# Altium project Project-C-V4.PrjPCB (part 1 of 3)
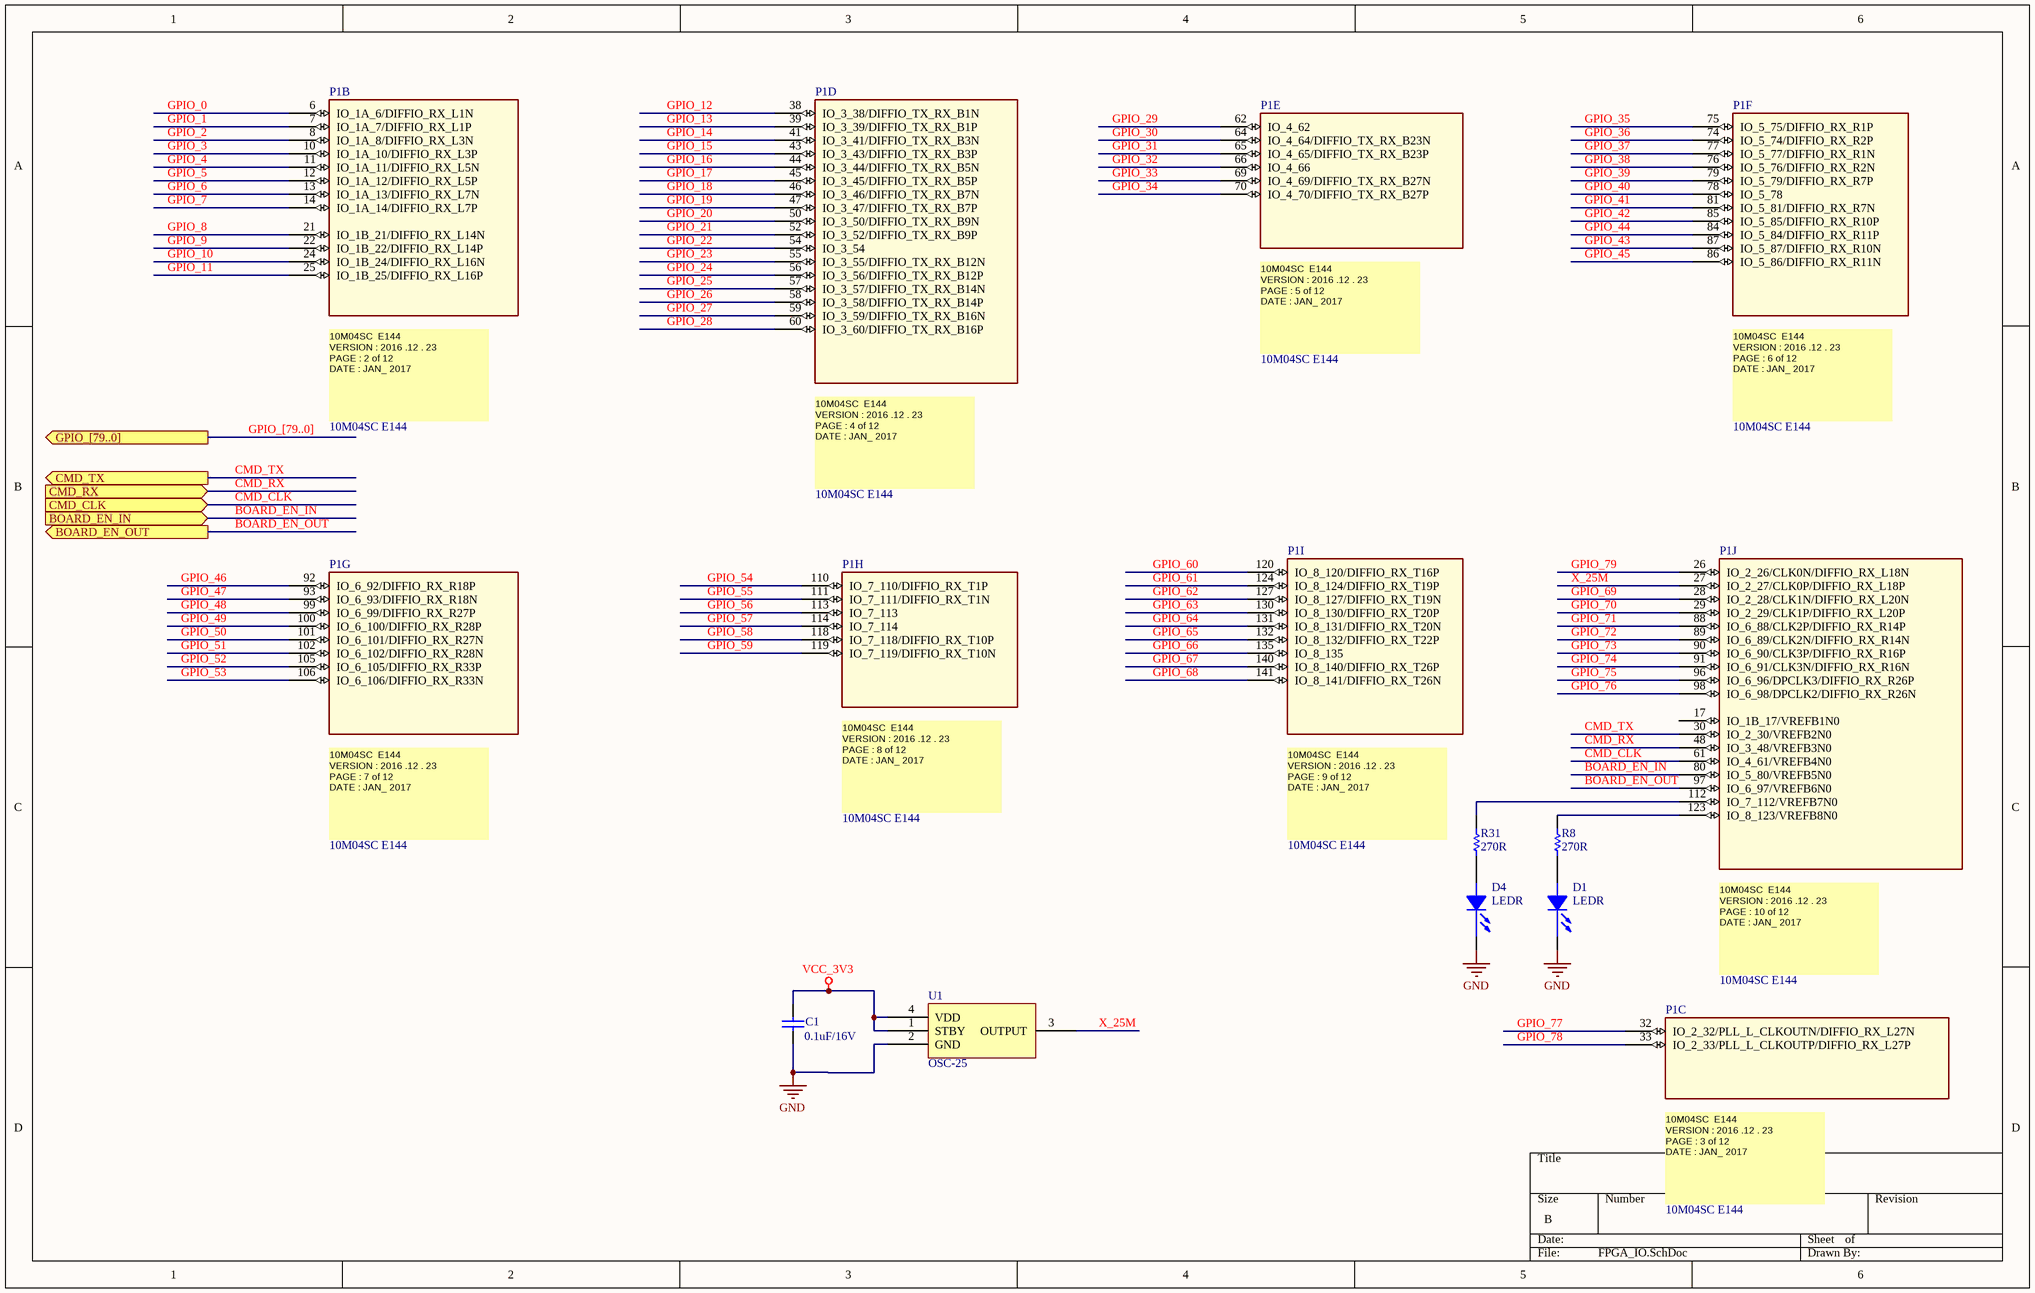
[diagram p0: FPGA_IO.SchDoc]
13 sheets, 1054 parts. Net scope: hierarchical (ports join the sheet entries above them; power ports are global).
Sheets:
  FPGA_IO.SchDoc
  FPGA_POWER.SchDoc
  FPGA_CONFIG.SchDoc
  TOP.SchDoc
    U_TOP_VOLTAGE = TOP_VOLTAGE.SchDoc
      VOLT1 = VoltageAmplifier.SchDoc
      VOLT2 = VoltageAmplifier.SchDoc
      VOLT3 = VoltageAmplifier.SchDoc
      VOLT4 = VoltageAmplifier.SchDoc
      VOLT5 = VoltageAmplifier.SchDoc
      VOLT6 = VoltageAmplifier.SchDoc
      VOLT7 = VoltageAmplifier.SchDoc
      VOLT8 = VoltageAmplifier.SchDoc
      VOLT9 = VoltageAmplifier.SchDoc
      VOLT10 = VoltageAmplifier.SchDoc
      VOLT11 = VoltageAmplifier.SchDoc
      VOLT12 = VoltageAmplifier.SchDoc
      VOLT13 = VoltageAmplifier.SchDoc
      VOLT14 = VoltageAmplifier.SchDoc
      VOLT15 = VoltageAmplifier.SchDoc
      VOLT16 = VoltageAmplifier.SchDoc
      VOLT17 = VoltageAmplifier.SchDoc
      VOLT18 = VoltageAmplifier.SchDoc
      VOLT19 = VoltageAmplifier.SchDoc
      VOLT20 = VoltageAmplifier.SchDoc
      VOLT21 = VoltageAmplifier.SchDoc
      VOLT22 = VoltageAmplifier.SchDoc
      VOLT23 = VoltageAmplifier.SchDoc
      VOLT24 = VoltageAmplifier.SchDoc
      VOLT25 = VoltageAmplifier.SchDoc
      VOLT26 = VoltageAmplifier.SchDoc
      VOLT27 = VoltageAmplifier.SchDoc
      VOLT28 = VoltageAmplifier.SchDoc
      VOLT29 = VoltageAmplifier.SchDoc
      VOLT30 = VoltageAmplifier.SchDoc
      VOLT31 = VoltageAmplifier.SchDoc
      VOLT32 = VoltageAmplifier.SchDoc
      VOLT33 = VoltageAmplifier.SchDoc
      VOLT34 = VoltageAmplifier.SchDoc
      VOLT35 = VoltageAmplifier.SchDoc
      VOLT36 = VoltageAmplifier.SchDoc
      VOLT37 = VoltageAmplifier.SchDoc
      VOLT38 = VoltageAmplifier.SchDoc
      VOLT39 = VoltageAmplifier.SchDoc
      VOLT40 = VoltageAmplifier.SchDoc
      VOLT41 = VoltageAmplifier.SchDoc
      VOLT42 = VoltageAmplifier.SchDoc
      VOLT43 = VoltageAmplifier.SchDoc
      VOLT44 = VoltageAmplifier.SchDoc
      VOLT45 = VoltageAmplifier.SchDoc
      VOLT46 = VoltageAmplifier.SchDoc
      VOLT47 = VoltageAmplifier.SchDoc
      VOLT48 = VoltageAmplifier.SchDoc
      VOLT49 = VoltageAmplifier.SchDoc
      VOLT50 = VoltageAmplifier.SchDoc
      VOLT51 = VoltageAmplifier.SchDoc
      VOLT52 = VoltageAmplifier.SchDoc
      VOLT53 = VoltageAmplifier.SchDoc
      VOLT54 = VoltageAmplifier.SchDoc
      VOLT55 = VoltageAmplifier.SchDoc
      VOLT56 = VoltageAmplifier.SchDoc
      VOLT57 = VoltageAmplifier.SchDoc
      VOLT58 = VoltageAmplifier.SchDoc
      VOLT59 = VoltageAmplifier.SchDoc
      VOLT60 = VoltageAmplifier.SchDoc
      VOLT61 = VoltageAmplifier.SchDoc
      VOLT62 = VoltageAmplifier.SchDoc
      VOLT63 = VoltageAmplifier.SchDoc
      VOLT64 = VoltageAmplifier.SchDoc
      VOLT65 = VoltageAmplifier.SchDoc
      VOLT66 = VoltageAmplifier.SchDoc
      VOLT67 = VoltageAmplifier.SchDoc
      VOLT68 = VoltageAmplifier.SchDoc
      VOLT69 = VoltageAmplifier.SchDoc
      VOLT70 = VoltageAmplifier.SchDoc
      VOLT71 = VoltageAmplifier.SchDoc
      VOLT72 = VoltageAmplifier.SchDoc
      VOLT73 = VoltageAmplifier.SchDoc
      VOLT74 = VoltageAmplifier.SchDoc
      VOLT75 = VoltageAmplifier.SchDoc
      VOLT76 = VoltageAmplifier.SchDoc
      VOLT77 = VoltageAmplifier.SchDoc
      VOLT78 = VoltageAmplifier.SchDoc
      VOLT79 = VoltageAmplifier.SchDoc
      VOLT80 = VoltageAmplifier.SchDoc
      VOLT81 = VoltageAmplifier.SchDoc
      VOLT82 = VoltageAmplifier.SchDoc
      VOLT83 = VoltageAmplifier.SchDoc
      VOLT84 = VoltageAmplifier.SchDoc
      VOLT85 = VoltageAmplifier.SchDoc
      VOLT86 = VoltageAmplifier.SchDoc
      VOLT87 = VoltageAmplifier.SchDoc
      VOLT88 = VoltageAmplifier.SchDoc
      VOLT89 = VoltageAmplifier.SchDoc
      VOLT90 = VoltageAmplifier.SchDoc
      VOLT91 = VoltageAmplifier.SchDoc
      VOLT92 = VoltageAmplifier.SchDoc
      VOLT93 = VoltageAmplifier.SchDoc
      VOLT94 = VoltageAmplifier.SchDoc
      VOLT95 = VoltageAmplifier.SchDoc
      VOLT96 = VoltageAmplifier.SchDoc
      VOLT97 = VoltageAmplifier.SchDoc
      VOLT98 = VoltageAmplifier.SchDoc
      VOLT99 = VoltageAmplifier.SchDoc
      VOLT100 = VoltageAmplifier.SchDoc
      VOLT101 = VoltageAmplifier.SchDoc
      VOLT102 = VoltageAmplifier.SchDoc
      VOLT103 = VoltageAmplifier.SchDoc
      VOLT104 = VoltageAmplifier.SchDoc
      VOLT105 = VoltageAmplifier.SchDoc
      VOLT106 = VoltageAmplifier.SchDoc
      VOLT107 = VoltageAmplifier.SchDoc
      VOLT108 = VoltageAmplifier.SchDoc
      VOLT109 = VoltageAmplifier.SchDoc
      VOLT110 = VoltageAmplifier.SchDoc
      VOLT111 = VoltageAmplifier.SchDoc
      VOLT112 = VoltageAmplifier.SchDoc
      VOLT113 = VoltageAmplifier.SchDoc
      VOLT114 = VoltageAmplifier.SchDoc
      VOLT115 = VoltageAmplifier.SchDoc
      VOLT116 = VoltageAmplifier.SchDoc
      VOLT117 = VoltageAmplifier.SchDoc
      VOLT118 = VoltageAmplifier.SchDoc
      VOLT119 = VoltageAmplifier.SchDoc
      VOLT120 = VoltageAmplifier.SchDoc
      VOLT121 = VoltageAmplifier.SchDoc
      VOLT122 = VoltageAmplifier.SchDoc
      VOLT123 = VoltageAmplifier.SchDoc
      VOLT124 = VoltageAmplifier.SchDoc
      VOLT125 = VoltageAmplifier.SchDoc
      VOLT126 = VoltageAmplifier.SchDoc
      VOLT127 = VoltageAmplifier.SchDoc
      VOLT128 = VoltageAmplifier.SchDoc
      VOLT129 = VoltageAmplifier.SchDoc
      VOLT130 = VoltageAmplifier.SchDoc
      VOLT131 = VoltageAmplifier.SchDoc
      VOLT132 = VoltageAmplifier.SchDoc
      VOLT133 = VoltageAmplifier.SchDoc
      VOLT134 = VoltageAmplifier.SchDoc
      VOLT135 = VoltageAmplifier.SchDoc
      VOLT136 = VoltageAmplifier.SchDoc
      VOLT137 = VoltageAmplifier.SchDoc
      VOLT138 = VoltageAmplifier.SchDoc
      VOLT139 = VoltageAmplifier.SchDoc
      VOLT140 = VoltageAmplifier.SchDoc
      VOLT141 = VoltageAmplifier.SchDoc
      VOLT142 = VoltageAmplifier.SchDoc
      VOLT143 = VoltageAmplifier.SchDoc
      VOLT144 = VoltageAmplifier.SchDoc
      VOLT145 = VoltageAmplifier.SchDoc
      VOLT146 = VoltageAmplifier.SchDoc
      VOLT147 = VoltageAmplifier.SchDoc
      VOLT148 = VoltageAmplifier.SchDoc
      VOLT149 = VoltageAmplifier.SchDoc
      VOLT150 = VoltageAmplifier.SchDoc
      VOLT151 = VoltageAmplifier.SchDoc
      VOLT152 = VoltageAmplifier.SchDoc
      VOLT153 = VoltageAmplifier.SchDoc
      VOLT154 = VoltageAmplifier.SchDoc
      VOLT155 = VoltageAmplifier.SchDoc
      VOLT156 = VoltageAmplifier.SchDoc
      VOLT157 = VoltageAmplifier.SchDoc
      VOLT158 = VoltageAmplifier.SchDoc
      VOLT159 = VoltageAmplifier.SchDoc
      VOLT160 = VoltageAmplifier.SchDoc
      U_VoltageHeaders = VoltageHeaders.SchDoc
    U_TOP_CONTROLLER = TOP_CONTROLLER.SchDoc
      U_WIFI = WIFI.SchDoc
      U_STM32 = STM32.SchDoc
      U_SDCARD_FLASH = SDCARD_FLASH.SchDoc
      U_LCD = LCD.SchDoc
      U_BOARD_CONNECTOR1 = BOARD_CONNECTOR.SchDoc
      U_BOARD_CONNECTOR2 = BOARD_CONNECTOR.SchDoc
      U_BOARD_CONNECTOR3 = BOARD_CONNECTOR.SchDoc
      U_BOARD_CONNECTOR4 = BOARD_CONNECTOR.SchDoc
      U_BOARD_CONNECTOR5 = BOARD_CONNECTOR.SchDoc
      U_BOARD_CONNECTOR6 = BOARD_CONNECTOR.SchDoc
      U_BOARD_CONNECTOR7 = BOARD_CONNECTOR.SchDoc
      U_BOARD_CONNECTOR8 = BOARD_CONNECTOR.SchDoc

## Sheet FPGA_IO.SchDoc
size B

### Parts
C1  0.1uF/16V  [0402_CAP]
D1  LEDR  [LED0603]
D4  LEDR  [LED0603]
P1  10M04SC E144  (parts B,C,D,E,F,G,H,I,J of 12)
R8  270R  [AXIAL-0.3]
R31  270R  [AXIAL-0.3]
U1  OSC-25  [ASE-25.000MHZ-LC-T]

### Ports
BOARD_EN_IN (in), BOARD_EN_OUT (out), CMD_CLK (in), CMD_RX (in), CMD_TX (out), GPIO_[79..0] (out)

### Nets
GND: C1.1 D1.2(CATHODE) D4.2(CATHODE) U1.2(GND)  [project net CMD_EN]
VCC_3V3: C1.2 U1.1(STBY) U1.4(VDD)  [project net RESET_N]
BOARD_EN_IN: P1.80(IO_5_80/VREFB5N0) ; port BOARD_EN_IN
BOARD_EN_OUT: P1.97(IO_6_97/VREFB6N0) ; port BOARD_EN_OUT
CMD_CLK: P1.61(IO_4_61/VREFB4N0) ; port CMD_CLK
CMD_RX: P1.48(IO_3_48/VREFB3N0) ; port CMD_RX
CMD_TX: P1.30(IO_2_30/VREFB2N0) ; port CMD_TX
GPIO_0: P1.6(IO_1A_6/DIFFIO_RX_L1N)
GPIO_1: P1.7(IO_1A_7/DIFFIO_RX_L1P)
GPIO_2: P1.8(IO_1A_8/DIFFIO_RX_L3N)
GPIO_3: P1.10(IO_1A_10/DIFFIO_RX_L3P)
GPIO_4: P1.11(IO_1A_11/DIFFIO_RX_L5N)
GPIO_5: P1.12(IO_1A_12/DIFFIO_RX_L5P)
GPIO_6: P1.13(IO_1A_13/DIFFIO_RX_L7N)
GPIO_7: P1.14(IO_1A_14/DIFFIO_RX_L7P)
GPIO_8: P1.21(IO_1B_21/DIFFIO_RX_L14N)
GPIO_9: P1.22(IO_1B_22/DIFFIO_RX_L14P)
GPIO_10: P1.24(IO_1B_24/DIFFIO_RX_L16N)
GPIO_11: P1.25(IO_1B_25/DIFFIO_RX_L16P)
GPIO_12: P1.38(IO_3_38/DIFFIO_TX_RX_B1N)
GPIO_13: P1.39(IO_3_39/DIFFIO_TX_RX_B1P)
GPIO_14: P1.41(IO_3_41/DIFFIO_TX_RX_B3N)
GPIO_15: P1.43(IO_3_43/DIFFIO_TX_RX_B3P)
GPIO_16: P1.44(IO_3_44/DIFFIO_TX_RX_B5N)
GPIO_17: P1.45(IO_3_45/DIFFIO_TX_RX_B5P)
GPIO_18: P1.46(IO_3_46/DIFFIO_TX_RX_B7N)
GPIO_19: P1.47(IO_3_47/DIFFIO_TX_RX_B7P)
GPIO_20: P1.50(IO_3_50/DIFFIO_TX_RX_B9N)
GPIO_21: P1.52(IO_3_52/DIFFIO_TX_RX_B9P)
GPIO_22: P1.54(IO_3_54)
GPIO_23: P1.55(IO_3_55/DIFFIO_TX_RX_B12N)
GPIO_24: P1.56(IO_3_56/DIFFIO_TX_RX_B12P)
GPIO_25: P1.57(IO_3_57/DIFFIO_TX_RX_B14N)
GPIO_26: P1.58(IO_3_58/DIFFIO_TX_RX_B14P)
GPIO_27: P1.59(IO_3_59/DIFFIO_TX_RX_B16N)
GPIO_28: P1.60(IO_3_60/DIFFIO_TX_RX_B16P)
GPIO_29: P1.62(IO_4_62)
GPIO_30: P1.64(IO_4_64/DIFFIO_TX_RX_B23N)
GPIO_31: P1.65(IO_4_65/DIFFIO_TX_RX_B23P)
GPIO_32: P1.66(IO_4_66)
GPIO_33: P1.69(IO_4_69/DIFFIO_TX_RX_B27N)
GPIO_34: P1.70(IO_4_70/DIFFIO_TX_RX_B27P)
GPIO_35: P1.75(IO_5_75/DIFFIO_RX_R1P)
GPIO_36: P1.74(IO_5_74/DIFFIO_RX_R2P)
GPIO_37: P1.77(IO_5_77/DIFFIO_RX_R1N)
GPIO_38: P1.76(IO_5_76/DIFFIO_RX_R2N)
GPIO_39: P1.79(IO_5_79/DIFFIO_RX_R7P)
GPIO_40: P1.78(IO_5_78)
GPIO_41: P1.81(IO_5_81/DIFFIO_RX_R7N)
GPIO_42: P1.85(IO_5_85/DIFFIO_RX_R10P)
GPIO_43: P1.87(IO_5_87/DIFFIO_RX_R10N)
GPIO_44: P1.84(IO_5_84/DIFFIO_RX_R11P)
GPIO_45: P1.86(IO_5_86/DIFFIO_RX_R11N)
GPIO_46: P1.92(IO_6_92/DIFFIO_RX_R18P)
GPIO_47: P1.93(IO_6_93/DIFFIO_RX_R18N)
GPIO_48: P1.99(IO_6_99/DIFFIO_RX_R27P)
GPIO_49: P1.100(IO_6_100/DIFFIO_RX_R28P)
GPIO_50: P1.101(IO_6_101/DIFFIO_RX_R27N)
GPIO_51: P1.102(IO_6_102/DIFFIO_RX_R28N)
GPIO_52: P1.105(IO_6_105/DIFFIO_RX_R33P)
GPIO_53: P1.106(IO_6_106/DIFFIO_RX_R33N)
GPIO_54: P1.110(IO_7_110/DIFFIO_RX_T1P)
GPIO_55: P1.111(IO_7_111/DIFFIO_RX_T1N)
GPIO_56: P1.113(IO_7_113)
GPIO_57: P1.114(IO_7_114)
GPIO_58: P1.118(IO_7_118/DIFFIO_RX_T10P)
GPIO_59: P1.119(IO_7_119/DIFFIO_RX_T10N)
GPIO_60: P1.120(IO_8_120/DIFFIO_RX_T16P)
GPIO_61: P1.124(IO_8_124/DIFFIO_RX_T19P)
GPIO_62: P1.127(IO_8_127/DIFFIO_RX_T19N)
GPIO_63: P1.130(IO_8_130/DIFFIO_RX_T20P)
GPIO_64: P1.131(IO_8_131/DIFFIO_RX_T20N)
GPIO_65: P1.132(IO_8_132/DIFFIO_RX_T22P)
GPIO_66: P1.135(IO_8_135)
GPIO_67: P1.140(IO_8_140/DIFFIO_RX_T26P)
GPIO_68: P1.141(IO_8_141/DIFFIO_RX_T26N)
GPIO_69: P1.28(IO_2_28/CLK1N/DIFFIO_RX_L20N)
GPIO_70: P1.29(IO_2_29/CLK1P/DIFFIO_RX_L20P)
GPIO_71: P1.88(IO_6_88/CLK2P/DIFFIO_RX_R14P)
GPIO_72: P1.89(IO_6_89/CLK2N/DIFFIO_RX_R14N)
GPIO_73: P1.90(IO_6_90/CLK3P/DIFFIO_RX_R16P)
GPIO_74: P1.91(IO_6_91/CLK3N/DIFFIO_RX_R16N)
GPIO_75: P1.96(IO_6_96/DPCLK3/DIFFIO_RX_R26P)
GPIO_76: P1.98(IO_6_98/DPCLK2/DIFFIO_RX_R26N)
GPIO_77: P1.32(IO_2_32/PLL_L_CLKOUTN/DIFFIO_RX_L27N)
GPIO_78: P1.33(IO_2_33/PLL_L_CLKOUTP/DIFFIO_RX_L27P)
GPIO_79: P1.26(IO_2_26/CLK0N/DIFFIO_RX_L18N)
X_25M: P1.27(IO_2_27/CLK0P/DIFFIO_RX_L18P) U1.3(OUTPUT)
NetD1_1: D1.1(ANODE) R8.1
NetD4_1: D4.1(ANODE) R31.1
NetP1_112: P1.112(IO_7_112/VREFB7N0) R31.2
NetP1_123: P1.123(IO_8_123/VREFB8N0) R8.2

Not connected (* = marked no-connect by the designer): P1 17(IO_1B_17/VREFB1N0)

### Buses and harness runs
bus GPIO_[79..0] = port GPIO_[79..0]

### Notes on the sheet
- (in symbol 10M04SC E144, part B) 10M04SC  E144 / VERSION : 2016 .12 . 23 / PAGE : 2 of 12 / DATE : JAN_ 2017 /
- (in symbol 10M04SC E144, part C) 10M04SC  E144 / VERSION : 2016 .12 . 23 / PAGE : 3 of 12 / DATE : JAN_ 2017 /
- (in symbol 10M04SC E144, part D) 10M04SC  E144 / VERSION : 2016 .12 . 23 / PAGE : 4 of 12 / DATE : JAN_ 2017 /
- (in symbol 10M04SC E144, part E) 10M04SC  E144 / VERSION : 2016 .12 . 23 / PAGE : 5 of 12 / DATE : JAN_ 2017 /
- (in symbol 10M04SC E144, part F) 10M04SC  E144 / VERSION : 2016 .12 . 23 / PAGE : 6 of 12 / DATE : JAN_ 2017 /
- (in symbol 10M04SC E144, part G) 10M04SC  E144 / VERSION : 2016 .12 . 23 / PAGE : 7 of 12 / DATE : JAN_ 2017 /
- (in symbol 10M04SC E144, part H) 10M04SC  E144 / VERSION : 2016 .12 . 23 / PAGE : 8 of 12 / DATE : JAN_ 2017 /
- (in symbol 10M04SC E144, part I) 10M04SC  E144 / VERSION : 2016 .12 . 23 / PAGE : 9 of 12 / DATE : JAN_ 2017 /
- (in symbol 10M04SC E144, part J) 10M04SC  E144 / VERSION : 2016 .12 . 23 / PAGE : 10 of 12 / DATE : JAN_ 2017 /
- (in symbol 10M04SC E144, part A) 10M04SC  E144 / VERSION : 2016 .12 . 23 / PAGE : 1 of 12 / DATE : JAN_ 2017 /
- (in symbol 10M04SC E144, part K) 10M04SC  E144 / VERSION : 2016 .12 . 23 / PAGE : 11 of 12 / DATE : JAN_ 2017 /
- (in symbol 10M04SC E144, part L) 10M04SC  E144 / VERSION : 2016 .12 . 23 / PAGE : 12 of 12 / DATE : JAN_ 2017 /

### Library data of the parts
C1 = Cap: Multilayer Ceramic Capacitors MLCC - SMD/SMT 10% AEC-Q200 16V 0.1uF X7R 0402; Mfr Part No: C0402T104K4RACTU; Manufacturer: KEMET; Value: 0.1uF/16V; Stockiest: MOUSER; Stockiest Part No: 80-C0402T104K4RACTU; Package: 0402; Price: 0.1
D1 D4 = LED: Standard LEDs - SMD Red 631nm 14mcd 5mA; Manufacturer: Lite-On; Mfr Part No: LTST-C193KRKT-5A; Package: 0603; Price: 0.28; Stockiest Part No: 859-LTSTC193KRKT5A; Value: RED; Stockiest: MOUSER
P1 = 10M04SC E144: SPLIT_INST: TRUE; SWAP_INFO: (S1+S2+S3+S4+S5+S6+S7+S8+S9+S10+S11+S12)
R8 R31 = Res1: Resistor; Published: 8-Jun-2000; LatestRevisionDate: 17-Jul-2002; LatestRevisionNote: Re-released for DXP Platform.; PackageReference: AXIAL-0.3; Publisher: Altium Limited; PackageDescription: Axial Device, Thru-Hole; 2 Leads; 0.3 in Pin Spacing; Value: 270R
U1 = CRYSTAL: Standard Clock Oscillators 25.0 MHZ 3.3V 50PPM SMD 32; Manufacturer: Abracon; Value: 25MHZ; Stockiest: MOUSER; Stockiest Part No: 815-ASE25.000MHZLCT; Mfr Part No: ASE-25.000MHZ-LC-T; Package: SMD; Price: 1.5

## Sheet FPGA_POWER.SchDoc
size B
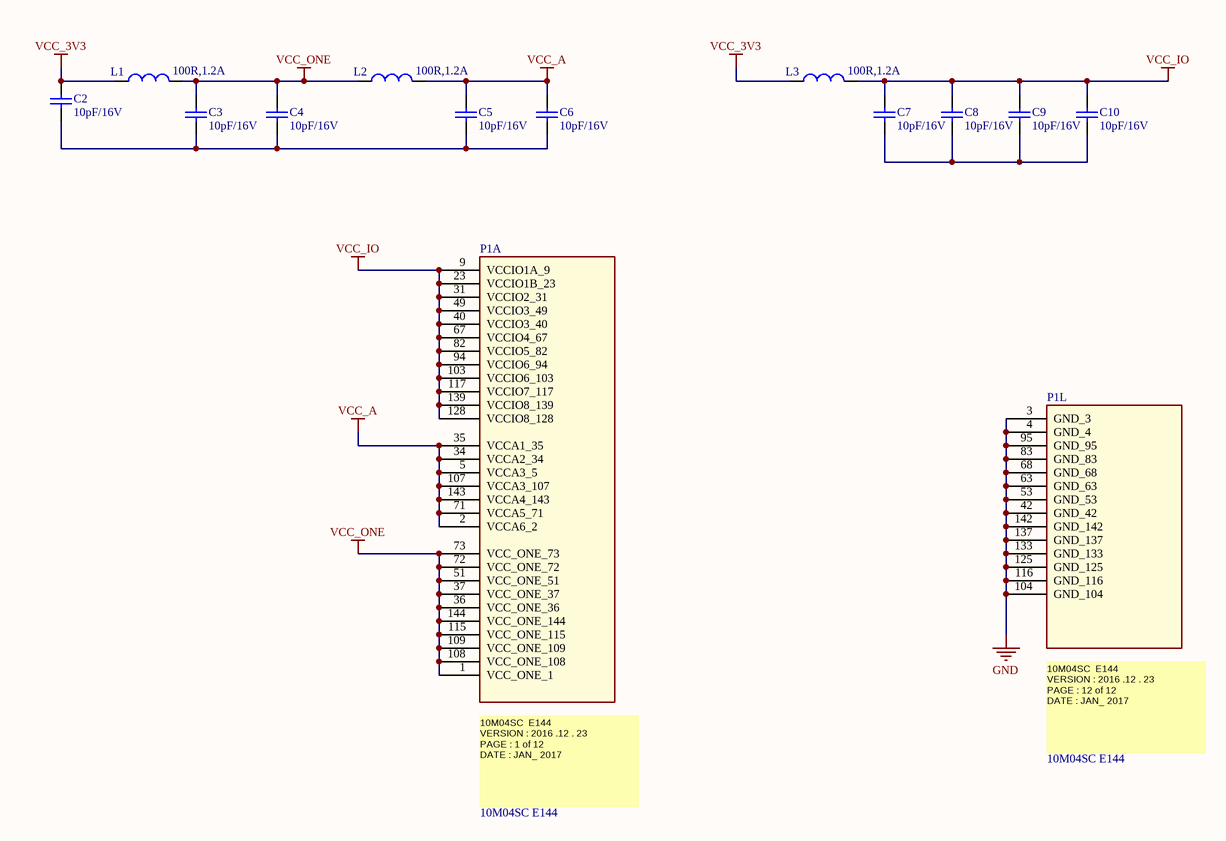
[diagram p1: FPGA_POWER.SchDoc]

### Parts
C2  10pF/16V  [RAD-0.3]
C3  10pF/16V  [RAD-0.3]
C4  10pF/16V  [RAD-0.3]
C5  10pF/16V  [RAD-0.3]
C6  10pF/16V  [RAD-0.3]
C7  10pF/16V  [RAD-0.3]
C8  10pF/16V  [RAD-0.3]
C9  10pF/16V  [RAD-0.3]
C10  10pF/16V  [RAD-0.3]
L1  100R,1.2A  [0603_IND]
L2  100R,1.2A  [0603_IND]
L3  100R,1.2A  [0603_IND]
P1  10M04SC E144  (parts A,L of 12)

### Nets
GND: P1.3(GND_3) P1.4(GND_4) P1.42(GND_42) P1.53(GND_53) P1.63(GND_63) P1.68(GND_68) P1.83(GND_83) P1.95(GND_95) P1.104(GND_104) P1.116(GND_116) P1.125(GND_125) P1.133(GND_133) P1.137(GND_137) P1.142(GND_142)  [project net CMD_EN]
VCC_3V3: C2.1 L1.1 L3.1  [project net RESET_N]
VCC_A: C5.1 C6.1 L2.2 P1.2(VCCA6_2) P1.5(VCCA3_5) P1.34(VCCA2_34) P1.35(VCCA1_35) P1.71(VCCA5_71) P1.107(VCCA3_107) P1.143(VCCA4_143)
VCC_IO: C7.1 C8.1 C9.1 C10.1 L3.2 P1.9(VCCIO1A_9) P1.23(VCCIO1B_23) P1.31(VCCIO2_31) P1.40(VCCIO3_40) P1.49(VCCIO3_49) P1.67(VCCIO4_67) P1.82(VCCIO5_82) P1.94(VCCIO6_94) P1.103(VCCIO6_103) P1.117(VCCIO7_117) P1.128(VCCIO8_128) P1.139(VCCIO8_139)
VCC_ONE: C3.1 C4.1 L1.2 L2.1 P1.1(VCC_ONE_1) P1.36(VCC_ONE_36) P1.37(VCC_ONE_37) P1.51(VCC_ONE_51) P1.72(VCC_ONE_72) P1.73(VCC_ONE_73) P1.108(VCC_ONE_108) P1.109(VCC_ONE_109) P1.115(VCC_ONE_115) P1.144(VCC_ONE_144)
NetC2_2: C2.2 C3.2 C4.2 C5.2 C6.2
NetC7_2: C7.2 C8.2 C9.2 C10.2

### Notes on the sheet
- (in symbol 10M04SC E144, part A) 10M04SC  E144 / VERSION : 2016 .12 . 23 / PAGE : 1 of 12 / DATE : JAN_ 2017 /
- (in symbol 10M04SC E144, part L) 10M04SC  E144 / VERSION : 2016 .12 . 23 / PAGE : 12 of 12 / DATE : JAN_ 2017 /

### Library data of the parts
C2-C10 = Cap: Capacitor; Published: 8-Jun-2000; LatestRevisionDate: 17-Jul-2002; LatestRevisionNote: Re-released for DXP Platform.; PackageReference: RAD-0.3; Publisher: Altium Limited; PackageDescription: Radial Cap, Thru-Hole; 2 Leads; 0.3 in Pin Spacing; Value: 10pF/16V
L1-L3 = 0805_IND: Ferrite Beads 100ohms 1A 60mOhms 0603 Ferrite Chip; Manufacturer: TDK; Mfr Part No: MPZ1608D101BTA00; Value: 100R/1A; Package: 0603; Stockiest Part No: 810-MPZ1608D101BTA00; Stockiest: MOUSER
P1 = 10M04SC E144: as P1 on sheet FPGA_IO

## Sheet FPGA_CONFIG.SchDoc
size B
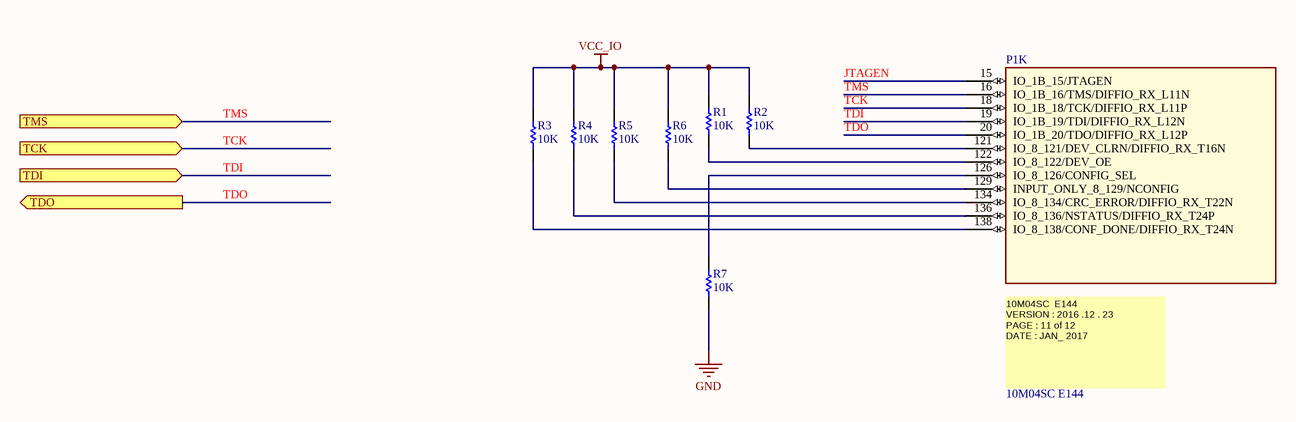
[diagram p2: FPGA_CONFIG.SchDoc]

### Parts
P1  10M04SC E144  (part K of 12)
R1  10K  [AXIAL-0.3]
R2  10K  [AXIAL-0.3]
R3  10K  [AXIAL-0.3]
R4  10K  [AXIAL-0.3]
R5  10K  [AXIAL-0.3]
R6  10K  [AXIAL-0.3]
R7  10K  [AXIAL-0.3]

### Ports
TCK (in), TDI (in), TDO (out), TMS (in)

### Nets
GND: R7.1  [project net CMD_EN]
VCC_IO: R1.2 R2.2 R3.2 R4.2 R5.2 R6.2
JTAGEN: P1.15(IO_1B_15/JTAGEN)
TCK: P1.18(IO_1B_18/TCK/DIFFIO_RX_L11P) ; port TCK
TDI: P1.19(IO_1B_19/TDI/DIFFIO_RX_L12N) ; port TDI
TDO: P1.20(IO_1B_20/TDO/DIFFIO_RX_L12P) ; port TDO
TMS: P1.16(IO_1B_16/TMS/DIFFIO_RX_L11N) ; port TMS
NetP1_121: P1.121(IO_8_121/DEV_CLRN/DIFFIO_RX_T16N) R2.1
NetP1_122: P1.122(IO_8_122/DEV_OE) R1.1
NetP1_126: P1.126(IO_8_126/CONFIG_SEL) R7.2
NetP1_129: P1.129(INPUT_ONLY_8_129/NCONFIG) R6.1
NetP1_134: P1.134(IO_8_134/CRC_ERROR/DIFFIO_RX_T22N) R5.1
NetP1_136: P1.136(IO_8_136/NSTATUS/DIFFIO_RX_T24P) R4.1
NetP1_138: P1.138(IO_8_138/CONF_DONE/DIFFIO_RX_T24N) R3.1

### Notes on the sheet
- (in symbol 10M04SC E144, part K) 10M04SC  E144 / VERSION : 2016 .12 . 23 / PAGE : 11 of 12 / DATE : JAN_ 2017 /

### Library data of the parts
P1 = 10M04SC E144: as P1 on sheet FPGA_IO
R1-R7 = Res1: Resistor; Published: 8-Jun-2000; LatestRevisionDate: 17-Jul-2002; LatestRevisionNote: Re-released for DXP Platform.; PackageReference: AXIAL-0.3; Publisher: Altium Limited; PackageDescription: Axial Device, Thru-Hole; 2 Leads; 0.3 in Pin Spacing; Value: 10K

## Sheet TOP.SchDoc
size B
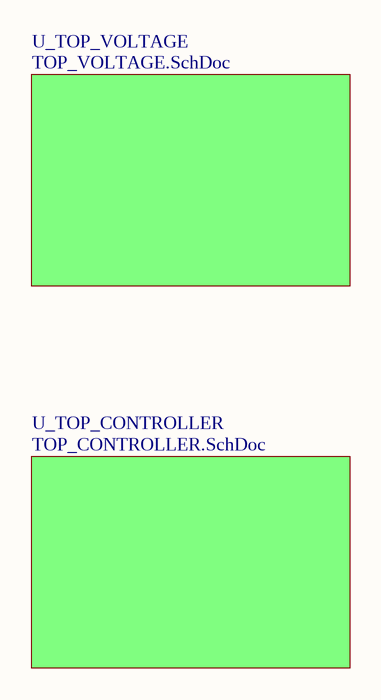
[diagram p3: TOP.SchDoc]

### Sub-sheets
U_TOP_CONTROLLER = TOP_CONTROLLER.SchDoc: no entries
U_TOP_VOLTAGE = TOP_VOLTAGE.SchDoc: no entries

## Sheet TOP_VOLTAGE.SchDoc
size A3
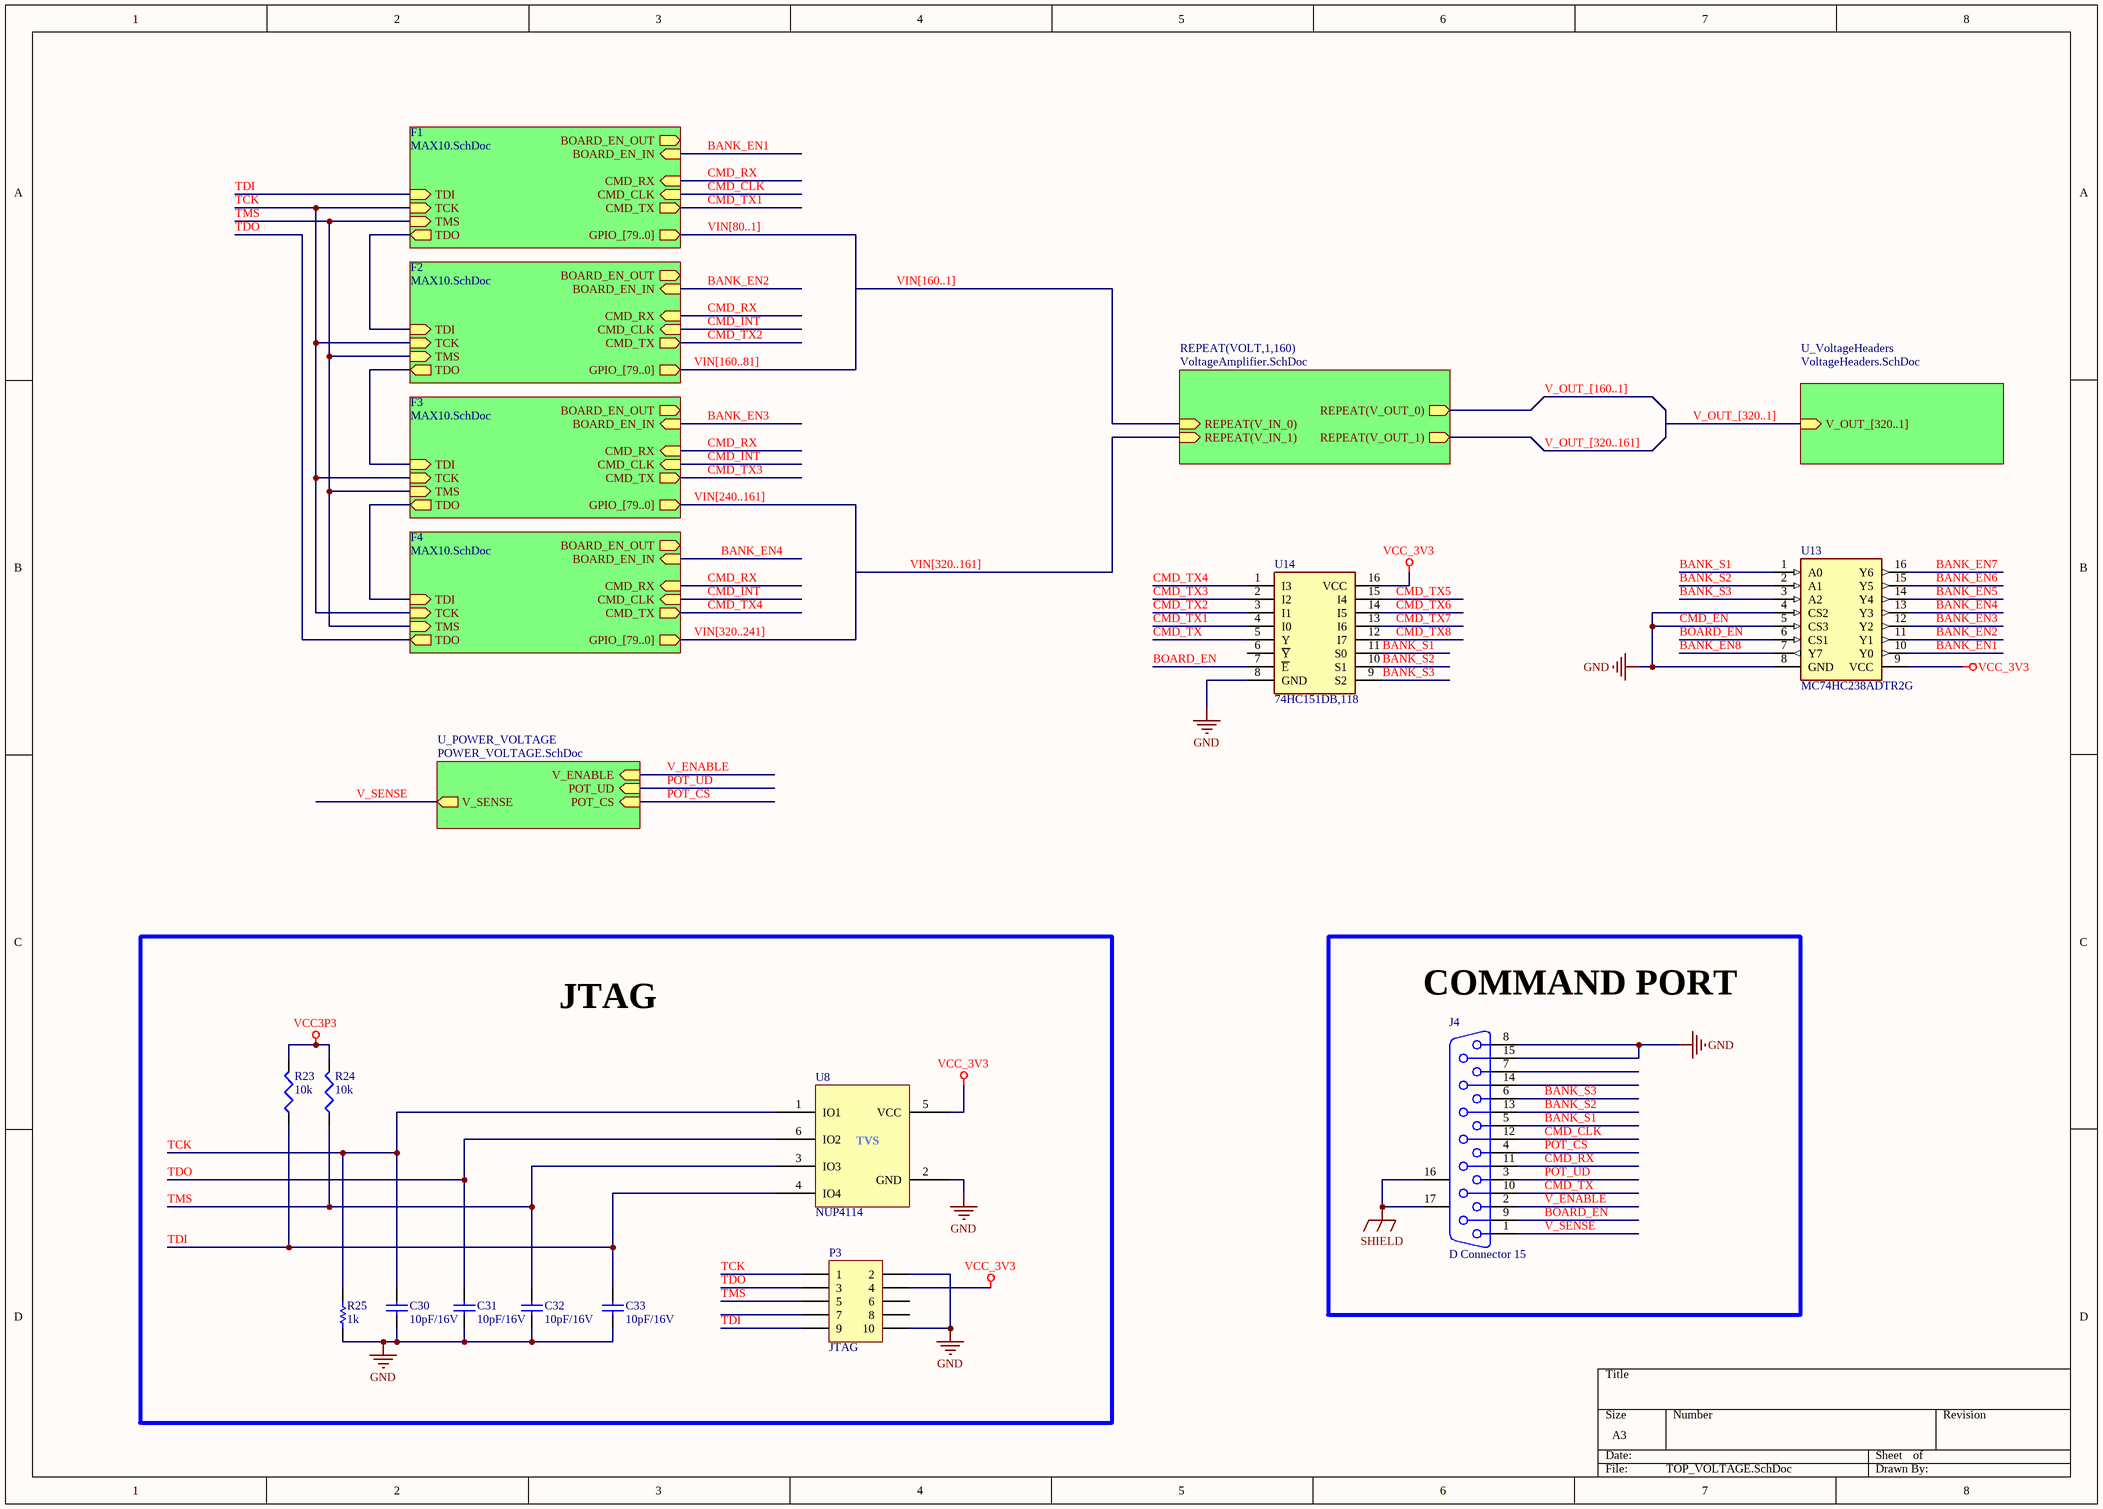
[diagram p4: TOP_VOLTAGE.SchDoc]

### Parts
C30  10pF/16V  [0603_CAP]
C31  10pF/16V  [0603_CAP]
C32  10pF/16V  [0603_CAP]
C33  10pF/16V  [0603_CAP]
J4  D Connector 15  [DSUB1.385-2H15]
P3  JTAG  [HDR2X5]
R23  10k  [0402_RES]
R24  10k  [0402_RES]
R25  1k  [RES_0805]
U8  NUP4114  [NUP4114HMR6T1G]
U13  MC74HC238ADTR2G  [SOP65P640X120-16N]
U14  74HC151DB,118  [SOP65P775X200-16N]

### Blocks framed on the sheet
JTAG: C30-C33 P3 R23-R25 U8
COMMAND PORT: J4

### Sub-sheets
F1 = MAX10.SchDoc (file not in this document): TDI (in), GPIO_[79..0] (out), TCK (in), TMS (in), TDO (out), CMD_RX (in), CMD_TX (out), BOARD_EN_IN (in), BOARD_EN_OUT (out), CMD_CLK (in)
F2 = MAX10.SchDoc (file not in this document): TDI (in), GPIO_[79..0] (out), TCK (in), TMS (in), TDO (out), CMD_TX (out), CMD_RX (in), BOARD_EN_OUT (out), BOARD_EN_IN (in), CMD_CLK (in)
F3 = MAX10.SchDoc (file not in this document): TDI (in), GPIO_[79..0] (out), TCK (in), TMS (in), TDO (out), CMD_TX (out), CMD_RX (in), CMD_CLK (in), BOARD_EN_IN (in), BOARD_EN_OUT (out)
F4 = MAX10.SchDoc (file not in this document): TDI (in), GPIO_[79..0] (out), TCK (in), TMS (in), TDO (out), CMD_TX (out), CMD_RX (in), BOARD_EN_IN (in), CMD_CLK (in), BOARD_EN_OUT (out)
REPEAT(VOLT,1,160) = VoltageAmplifier.SchDoc: REPEAT(V_IN_0) (in), REPEAT(V_OUT_0) (out), REPEAT(V_OUT_1) (out), REPEAT(V_IN_1) (in)
U_POWER_VOLTAGE = POWER_VOLTAGE.SchDoc (file not in this document): V_SENSE (out), V_ENABLE (in), POT_UD (in), POT_CS (in)
U_VoltageHeaders = VoltageHeaders.SchDoc: V_OUT_[320..1] (in)

### Nets
CMD_EN: C30.1 C31.1 C32.1 C33.1 J4.8 J4.15 P3.2 P3.10 R25.2 U8.2(GND) U13.4(CS2) U13.5(CS3) U13.8(GND) U14.8(GND)  [also labelled GND]
SHIELD: J4.16(MH1) J4.17(MH2)
VCC3P3: R23.2 R24.2
VCC_3V3: P3.4 U8.5(VCC) U13.9(VCC) U14.16(VCC)  [project net RESET_N]
BANK_EN1: U13.10(Y0) ; sheet F1/BOARD_EN_IN
BANK_EN2: U13.11(Y1) ; sheet F2/BOARD_EN_IN
BANK_EN3: U13.12(Y2) ; sheet F3/BOARD_EN_IN
BANK_EN4: U13.13(Y3) ; sheet F4/BOARD_EN_IN
BANK_EN5: U13.14(Y4)
BANK_EN6: U13.15(Y5)
BANK_EN7: U13.16(Y6)
BANK_EN8: U13.7(Y7)
BANK_S1: J4.5 U13.1(A0) U14.11(S0)
BANK_S2: J4.13 U13.2(A1) U14.10(S1)
BANK_S3: J4.6 U13.3(A2) U14.9(S2)
BOARD_EN: J4.9 U13.6(CS1) U14.7(~{E})
CMD_CLK: J4.12 ; sheet F1/CMD_CLK
CMD_INT: sheet F2/CMD_CLK, sheet F3/CMD_CLK, sheet F4/CMD_CLK
CMD_RX: J4.11 ; sheet F1/CMD_RX, sheet F2/CMD_RX, sheet F3/CMD_RX, sheet F4/CMD_RX
CMD_TX: J4.10 U14.5(Y)
CMD_TX1: U14.4(I0) ; sheet F1/CMD_TX
CMD_TX2: U14.3(I1) ; sheet F2/CMD_TX
CMD_TX3: U14.2(I2) ; sheet F3/CMD_TX
CMD_TX4: U14.1(I3) ; sheet F4/CMD_TX
CMD_TX5: U14.15(I4)
CMD_TX6: U14.14(I5)
CMD_TX7: U14.13(I6)
CMD_TX8: U14.12(I7)
POT_CS: J4.4 ; sheet U_POWER_VOLTAGE/POT_CS
POT_UD: J4.3 ; sheet U_POWER_VOLTAGE/POT_UD
TCK: C30.2 P3.1 R25.1 U8.1(IO1) ; sheet F1/TCK, sheet F2/TCK, sheet F3/TCK, sheet F4/TCK
TDI: C33.2 P3.9 R23.1 U8.4(IO4) ; sheet F1/TDI
TDO: C31.2 P3.3 U8.6(IO2) ; sheet F4/TDO
TMS: C32.2 P3.5 R24.1 U8.3(IO3) ; sheet F1/TMS, sheet F2/TMS, sheet F3/TMS, sheet F4/TMS
V_ENABLE: J4.2 ; sheet U_POWER_VOLTAGE/V_ENABLE
V_OUT_[160..1]: sheet REPEAT(VOLT,1,160)/REPEAT(V_OUT_0)
V_OUT_[320..161]: sheet REPEAT(VOLT,1,160)/REPEAT(V_OUT_1)
V_SENSE: J4.1 ; sheet U_POWER_VOLTAGE/V_SENSE
(unnamed): sheet F1/TDO, sheet F2/TDI
(unnamed): sheet F2/TDO, sheet F3/TDI
(unnamed): sheet F3/TDO, sheet F4/TDI

Not connected (* = marked no-connect by the designer): J4 7 14; P3 6 7 8; U14 6(~{Y})

### Buses and harness runs
bus V_OUT_[320..1] = sheet U_VoltageHeaders/V_OUT_[320..1]
bus VIN[80..1] = VIN[160..1] = VIN[160..81] = sheet F1/GPIO_[79..0] = sheet F2/GPIO_[79..0]
bus VIN[240..161] = VIN[320..161] = VIN[320..241] = sheet F3/GPIO_[79..0] = sheet F4/GPIO_[79..0]

### Notes on the sheet
- (in symbol NUP4114) TVS

### Library data of the parts
C30-C33 = Cap: Multilayer Ceramic Capacitors MLCC - SMD/SMT 16V 10pF 0603 X7R 0.1; Mfr Part No: C0603C100K4RACTU; Manufacturer: KEMET; Value: 10pF/16V; Stockiest: MOUSER; Stockiest Part No: 80-C0603C100K4RACTU; Package: 0603; Price: 0.1
J4 = D Connector 15: Receptacle Assembly, 15 Position, Right Angle; PackageDocument: O; Positions: 15; Published: 15-Jun-2001; LatestRevisionDate: 17-Jul-2002; LatestRevisionNote: Re-released for DXP Platform.; DatasheetDocument: 1-Sep-99; PackageReference: 788757; Publisher: Altium Limited; Orientation: Right Angle; Gender: Receptacle
P3 = Header 5X2: Header, 5-Pin, Dual row; LatestRevisionDate: 17-Jul-2002; LatestRevisionNote: Re-released for DXP Platform.; Publisher: Altium Limited
R23 R24 = 0402_RES: Thick Film Resistors - SMD 10K OHM 1%; Manufacturer: Yageo; Mfr Part No: RC0402FR-0710KL; Package: 0402; Price: 0.1; Stockiest Part No: 603-RC0402FR-0710KL; Value: 10k; Stockiest: MOUSER
R25 = Res1: Thick Film Resistors - SMD 1/16W 1K Ohm 50V 1% ANTI SULFUR AEC-Q200; Mfr Part No: AA0402FR-071KL; Manufacturer: Yageo; Value: 1k; Stockiest: MOUSER; Stockiest Part No: 603-AA0402FR-071KL; Package: 0402; Price: 0.1
U8 = NUP4114: ESD Suppressors / TVS Diodes LOW CAP TVS ARRAY 5.5V; Manufacturer: ON Semi; Mfr Part No: NUP4114HMR6T1G; Package: SMD; Price: 0.529; Stockiest: MOUSER; Stockiest Part No: 863-NUP4114HMR6T1G; Value: 5.5V
U13 = MC74HC238ADTR2G: Integrated Circuit; Manufacturer_Name: ON Semiconductor; Datasheet Link: https://componentsearchengine.com/Datasheets/2/MC74HC238ADTR2G.pdf; Height: 1.2mm; Manufacturer_Part_Number: MC74HC238ADTR2G; Arrow Part Number: MC74HC238ADTR2G; Arrow Price/Stock: https://www.arrow.com/en/products/mc74hc238adtr2g/on-semiconductor; Mouser Part Number: 863-MC74HC238ADTR2G; Mouser Price/Stock: https://www.mouser.co.uk/ProductDetail/ON-Semiconductor/MC74HC238ADTR2G?qs=mB5q98eOMcYIHVTp70gNug%3D%3D
U14 = 74HC151DB,118: Integrated Circuit; Manufacturer_Name: Nexperia; Datasheet Link: https://assets.nexperia.com/documents/data-sheet/74HC_HCT151.pdf; Height: 2mm; Manufacturer_Part_Number: 74HC151DB,118; Arrow Part Number: 74HC151DB,118; Arrow Price/Stock: https://www.arrow.com/en/products/74hc151db118/nexperia; Mouser Part Number: 771-HC151DB118; Mouser Price/Stock: https://www.mouser.co.uk/ProductDetail/Nexperia/74HC151DB118?qs=P62ublwmbi%252BDFn2LoumROw%3D%3D